# EasyEDA Pro project ProProject_运放实验_2024-09-24.epro, board PCB2
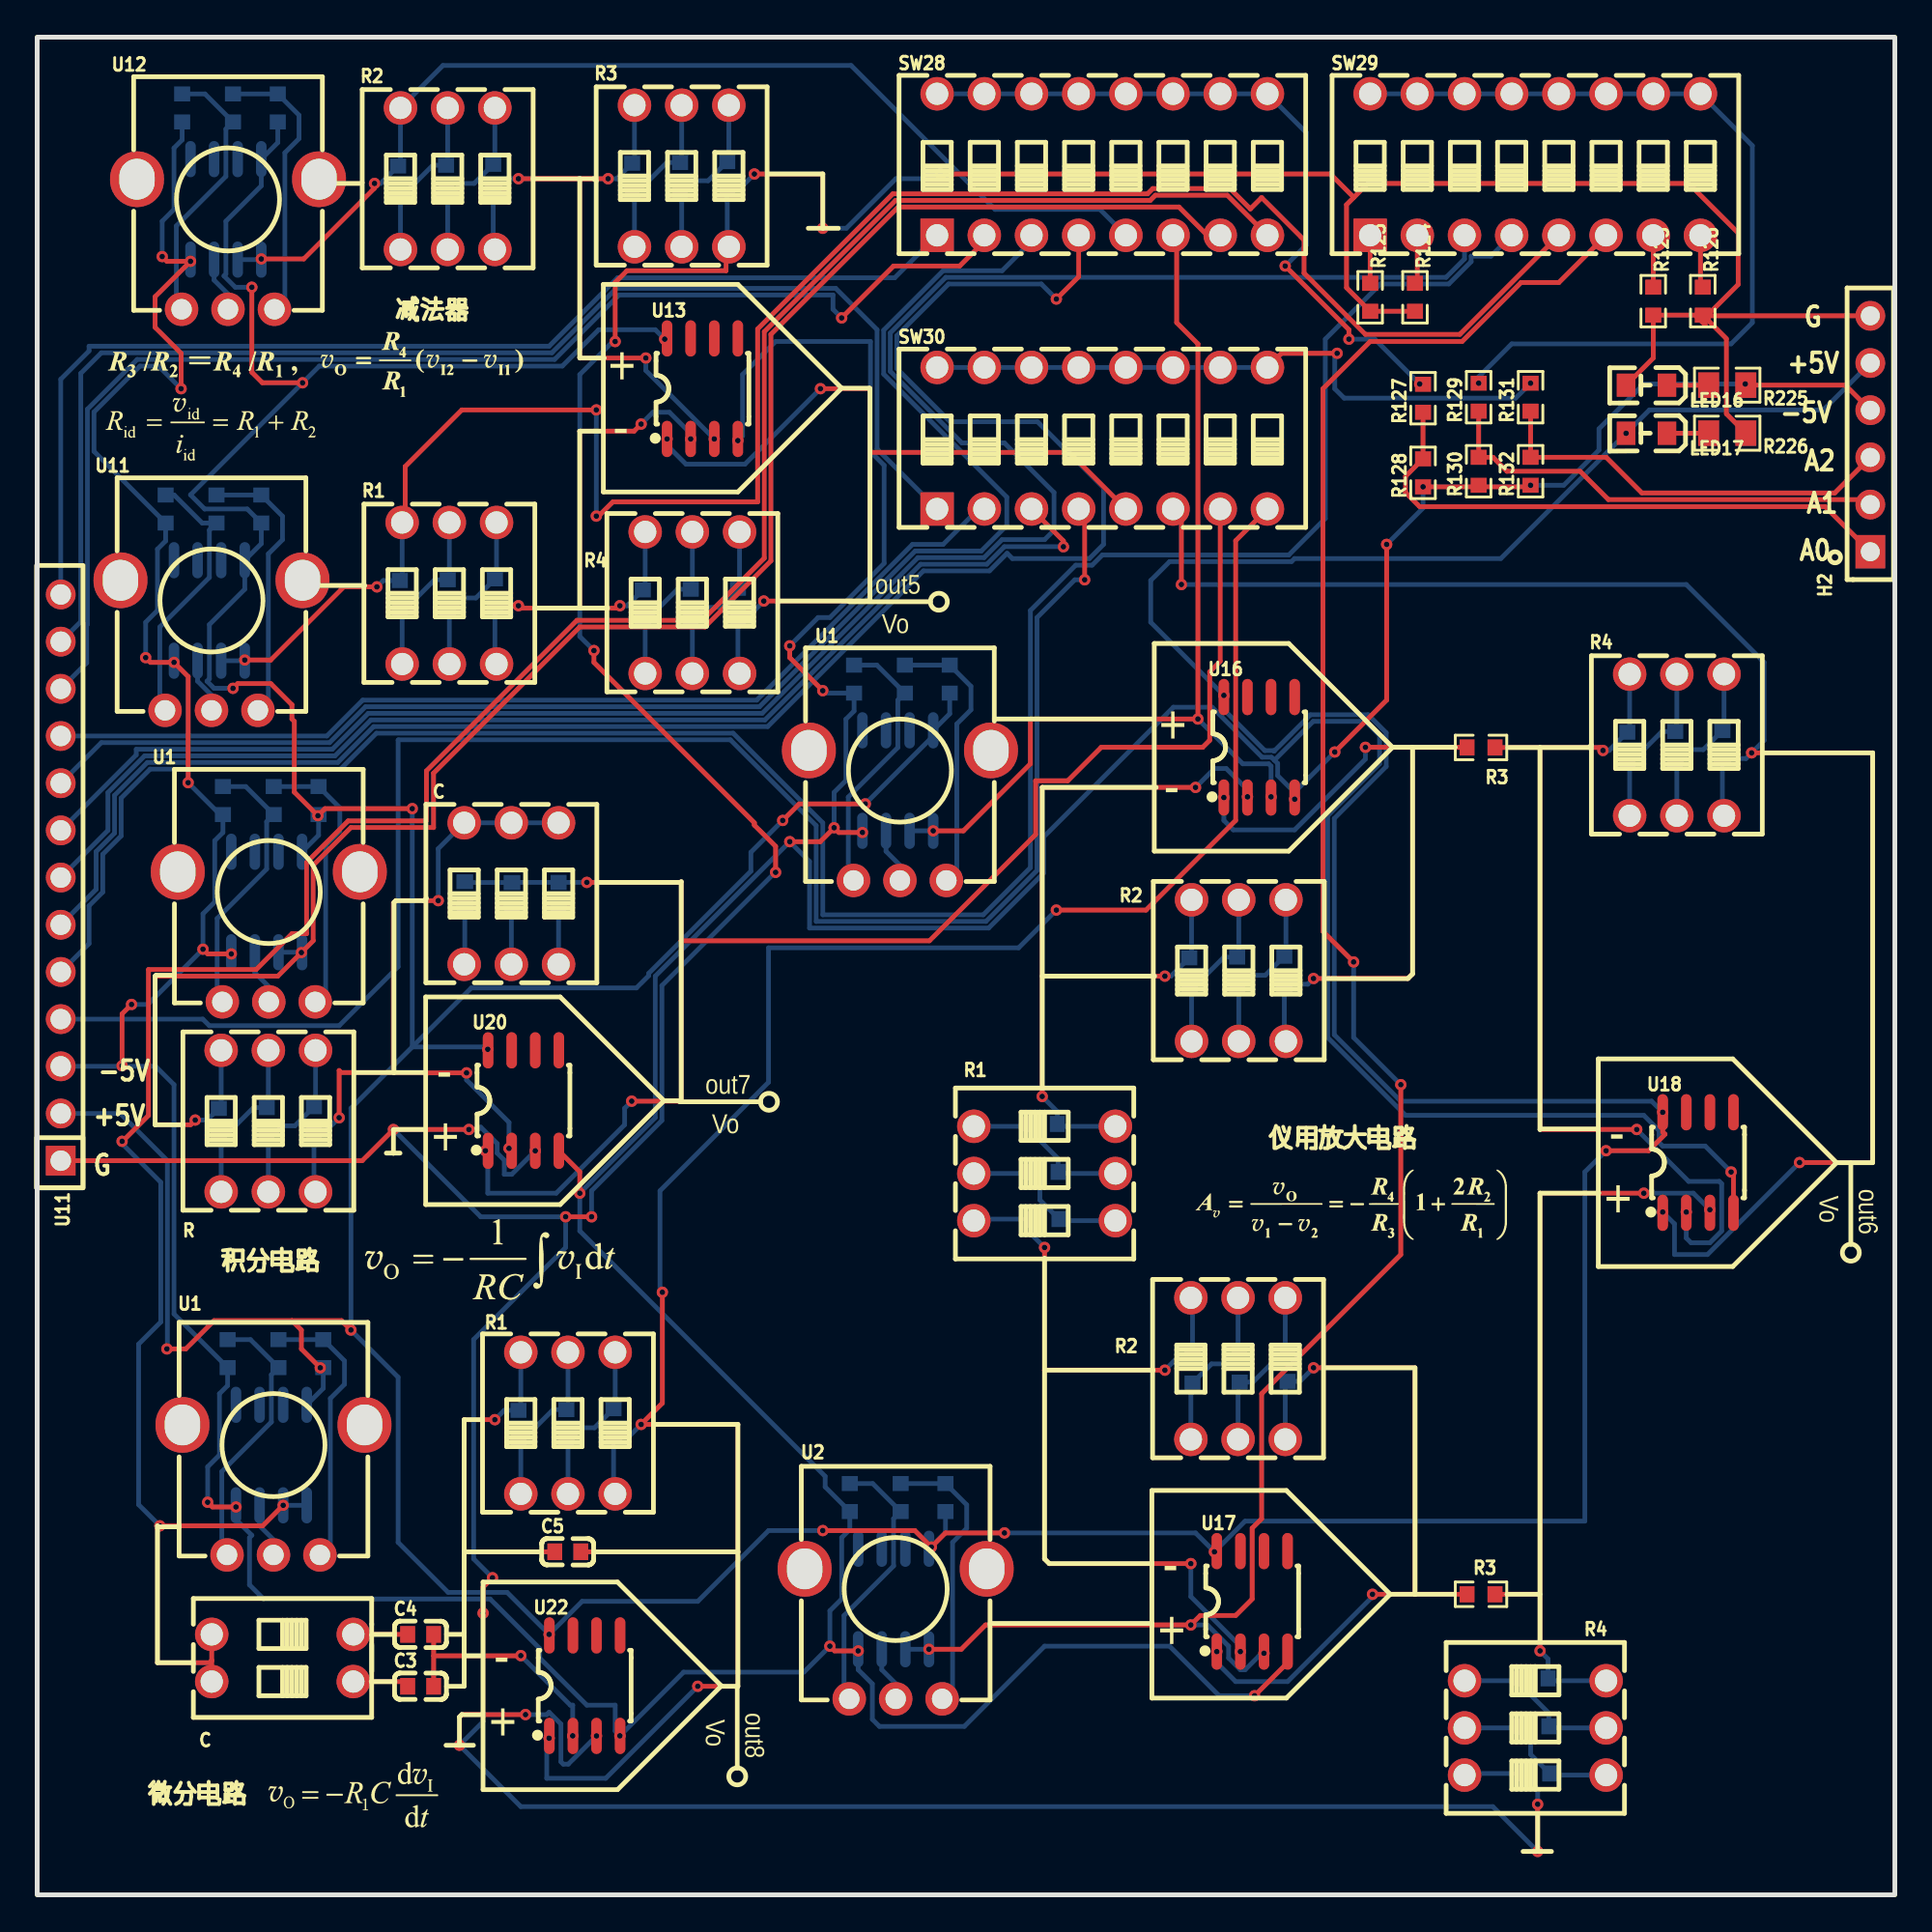
[diagram p11: board, top side]
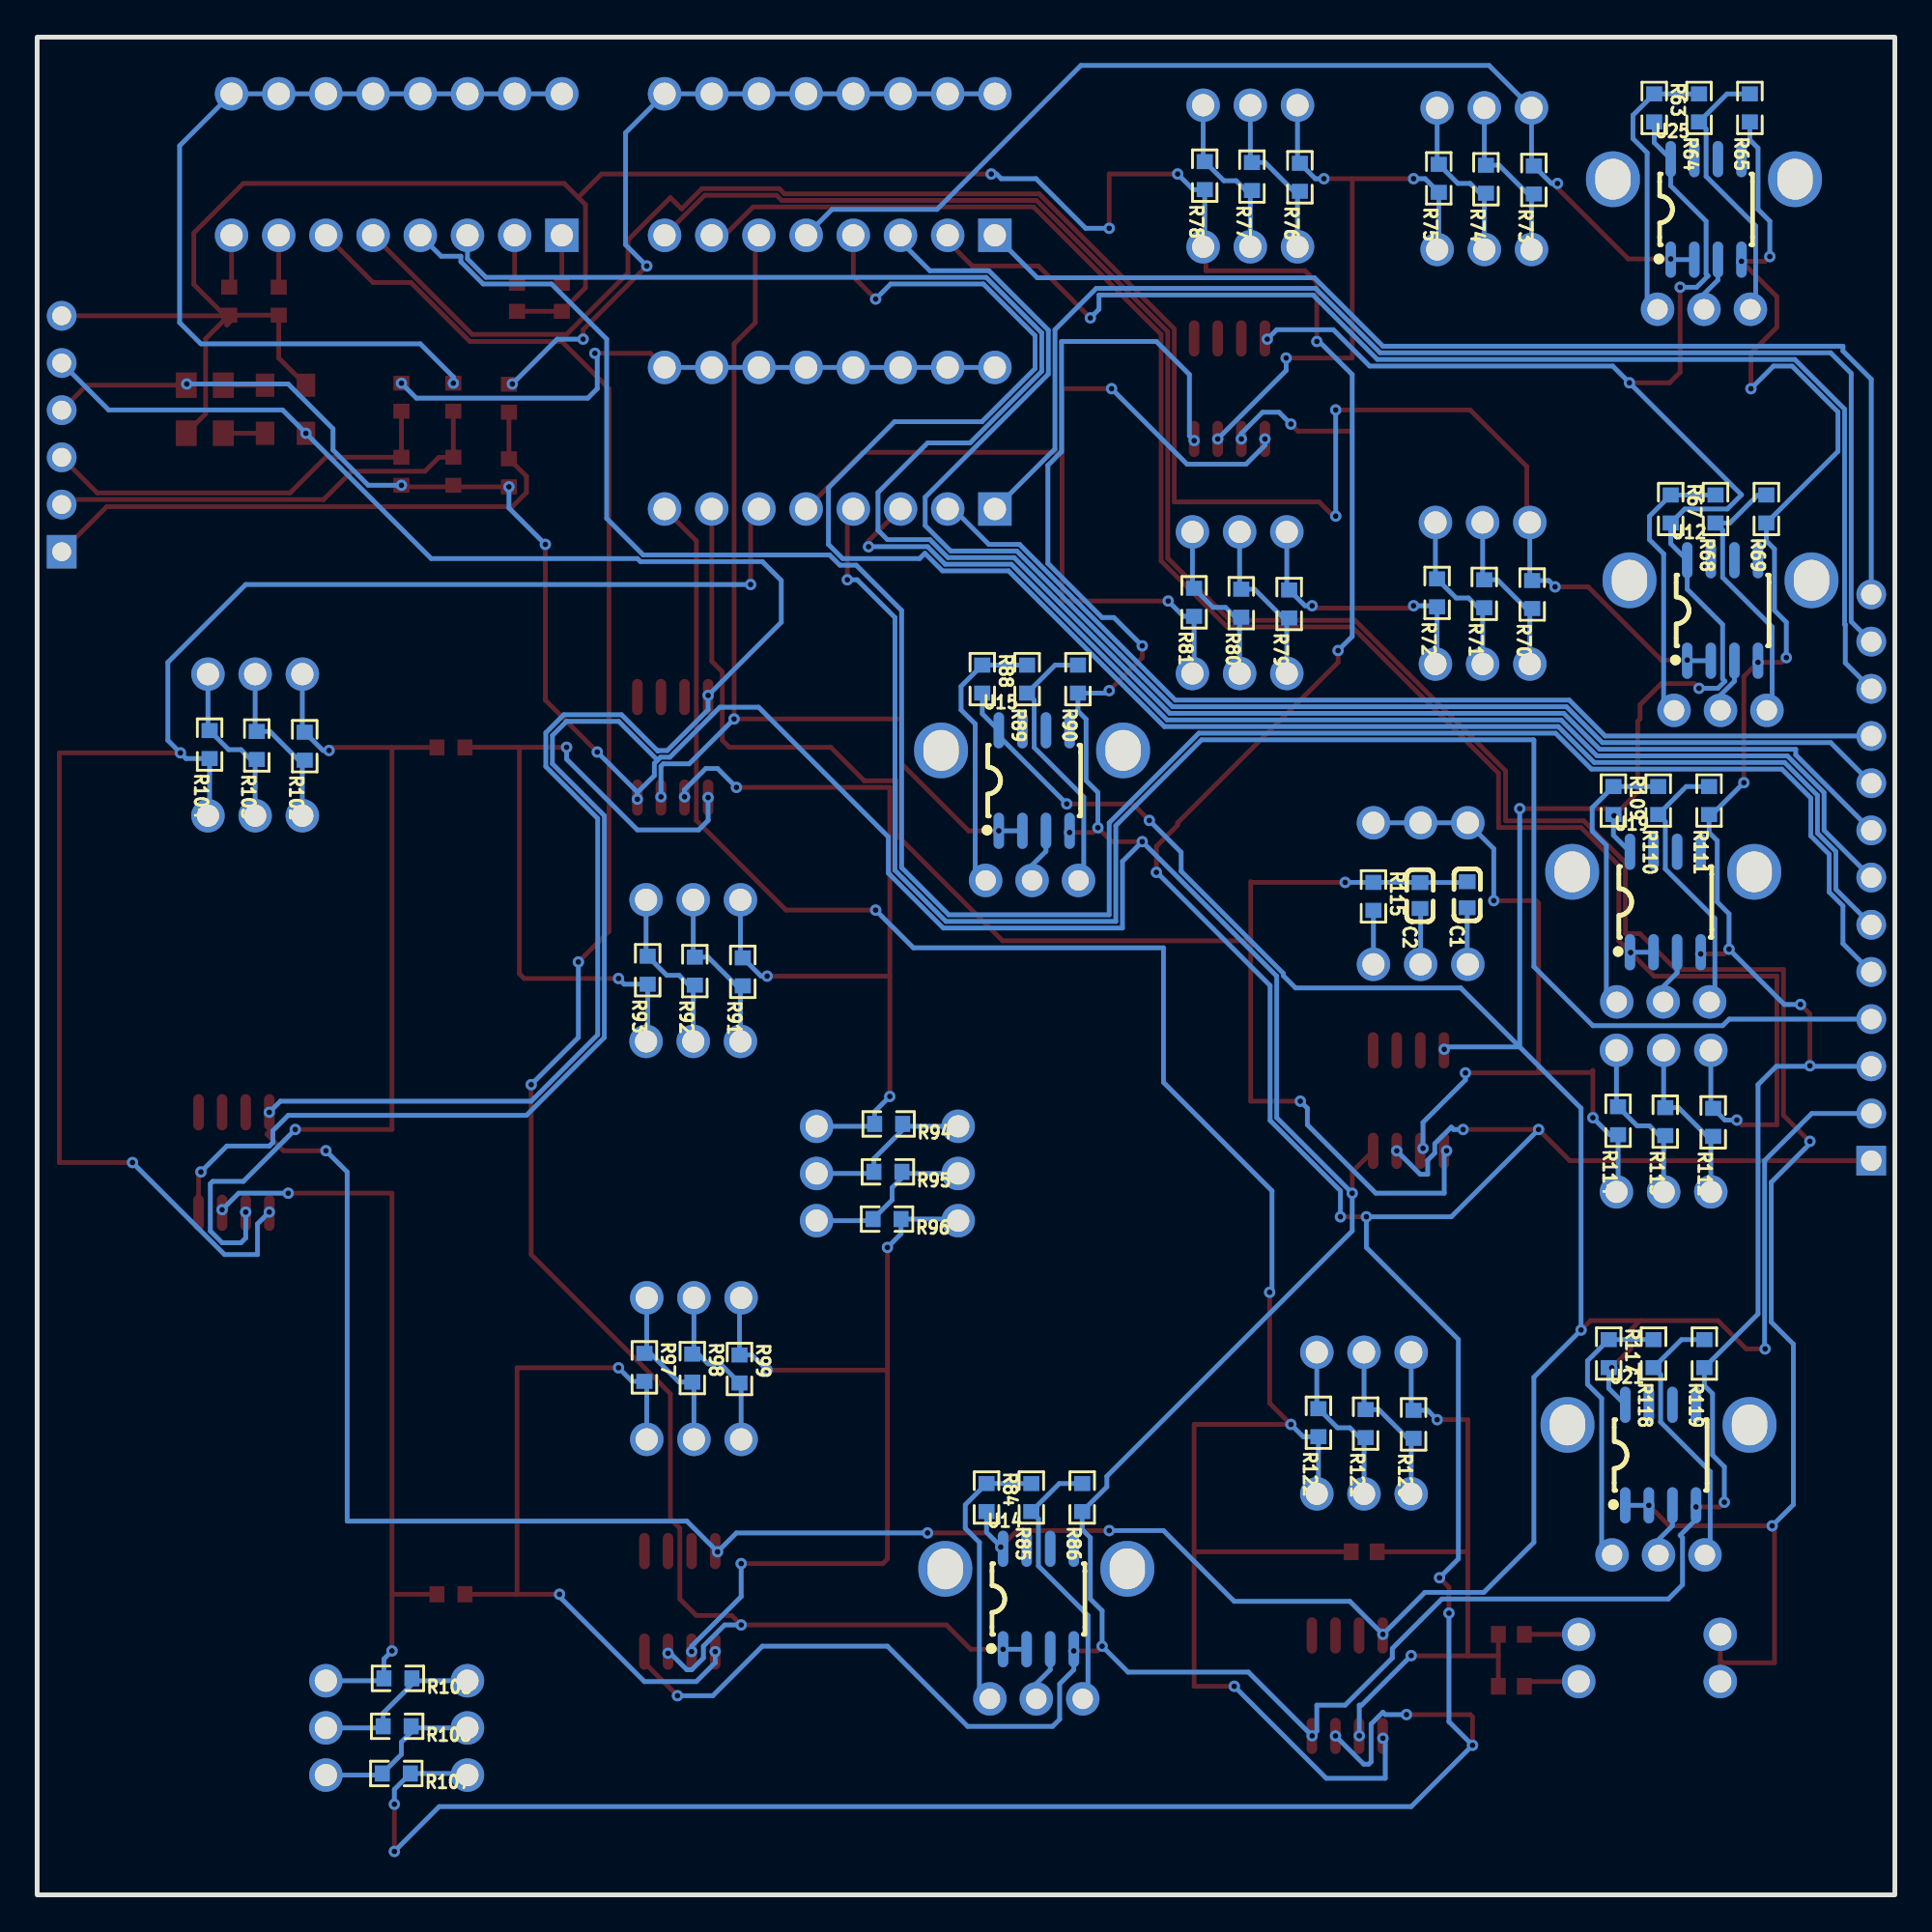
[diagram p12: board, bottom side, seen from below]

Outline 100 x 100 mm; copper layers: Top Layer, Bottom Layer. Coordinates in mm from the lower left corner of the outline.
Outline path: rectangle 0,100 100,0
Stack: Top Layer 0.035mm - / Dielectric1 1.51mm FR4 er 4.5 / Bottom Layer 0.035mm -

## Design rules (mm)
template: JLCPCB Capability(Two Layers Board)
spacing copperThickness1oz (default): track to track 0.102, other pairs 0.152 to 0.3
spacing copperThickness2oz: track to track 0.203, other pairs 0.152 to 0.3
track width copperThickness1oz (default): min 0.127, default 0.254, max 2.54
track width copperThickness2oz: min 0.203, default 0.254, max 2.54
differential pair differentialPair (default): width min 0.127, default 0.254, max 2.54; gap min 0.152, default 0.152
via viaSize (default): diameter min 0.5, default 0.61, max 10; hole min 0.3, default 0.305, max 6.3

## Placement (name value [footprint] x y rotation side)
C  -  [SW-TH_DSWB02LHGET]  13.21 12.75 90 top
C1  100uF  [C0603]  23.02 53.84 90 bottom
C2  1uF  [C0603]  25.56 53.79 90 bottom
C3  100uF  [C0603]  20.64 11.23 0 top
C4  1uF  [C0603]  20.64 14.02 0 top
C5  1uF  [C0603]  28.56 18.47 0 top
C#2  -  [SW-TH_DSWB03LHGET]  25.53 53.9 0 top
H2  PM254V-11-06-H85  [HDR-TH_6P-P2.54-V-F]  98.68 78.65 90 top
LED16  -  [LED_0805]  86.58 81.27 180 top
LED17  -  [LED_0805]  86.58 78.68 180 top
R  DSWB03LHGET  [SW-TH_DSWB03LHGET]  12.45 41.65 0 top
R1  -  [SW-TH_DSWB03LHGET]  54.23 38.83 270 top
R1#2  -  [SW-TH_DSWB03LHGET]  22.19 70.06 0 top
R1#3  -  [SW-TH_DSWB03LHGET]  28.57 25.4 0 top
R2  -  [SW-TH_DSWB03LHGET]  64.65 28.33 180 top
R2#2  -  [SW-TH_DSWB03LHGET]  64.68 49.75 0 top
R2#3  -  [SW-TH_DSWB03LHGET]  22.1 92.38 0 top
R3  -  [SW-TH_DSWB03LHGET]  34.69 92.53 0 top
R3#2  -  [R0603]  77.72 16.18 180 top
R3#3  -  [R0603]  77.72 61.76 180 top
R4  -  [SW-TH_DSWB03LHGET]  80.65 8.99 270 top
R4#2  -  [SW-TH_DSWB03LHGET]  88.26 61.9 0 top
R4#3  -  [SW-TH_DSWB03LHGET]  35.27 69.56 0 top
R63  4kΩ  [R0603]  12.95 96.19 270 bottom
R64  2kΩ  [R0603]  10.54 96.19 90 bottom
R65  4kΩ  [R0603]  7.81 96.19 90 bottom
R67  4kΩ  [R0603]  12.06 74.6 270 bottom
R68  2kΩ  [R0603]  9.65 74.6 90 bottom
R69  4kΩ  [R0603]  6.92 74.6 90 bottom
R70  1kΩ  [R0603]  19.52 70 90 bottom
R71  1kΩ  [R0603]  22.1 70.04 90 bottom
R72  1kΩ  [R0603]  24.64 70.08 90 bottom
R73  1kΩ  [R0603]  19.43 92.31 90 bottom
R74  1kΩ  [R0603]  22.01 92.35 90 bottom
R75  1kΩ  [R0603]  24.55 92.4 90 bottom
R76  1kΩ  [R0603]  32.03 92.46 90 bottom
R77  1kΩ  [R0603]  34.61 92.5 90 bottom
R78  1kΩ  [R0603]  37.15 92.55 90 bottom
R79  1kΩ  [R0603]  32.6 69.49 90 bottom
R80  1kΩ  [R0603]  35.18 69.53 90 bottom
R81  1kΩ  [R0603]  37.72 69.58 90 bottom
R84  4kΩ  [R0603]  48.9 21.39 270 bottom
R85  2kΩ  [R0603]  46.48 21.39 90 bottom
R86  4kΩ  [R0603]  43.75 21.39 90 bottom
R88  4kΩ  [R0603]  49.12 65.44 270 bottom
R89  2kΩ  [R0603]  46.71 65.44 90 bottom
R90  4kΩ  [R0603]  43.97 65.44 90 bottom
R91  1kΩ  [R0603]  62.02 49.69 90 bottom
R92  1kΩ  [R0603]  64.6 49.72 90 bottom
R93  1kΩ  [R0603]  67.14 49.77 90 bottom
R94  1kΩ  [R0603]  54.16 41.5 0 bottom
R95  1kΩ  [R0603]  54.2 38.92 0 bottom
R96  1kΩ  [R0603]  54.25 36.38 0 bottom
R97  1kΩ  [R0603]  67.31 28.4 270 bottom
R98  1kΩ  [R0603]  64.73 28.36 270 bottom
R99  1kΩ  [R0603]  62.19 28.31 270 bottom
R102  1kΩ  [R0603]  85.6 61.83 90 bottom
R103  1kΩ  [R0603]  88.18 61.87 90 bottom
R104  1kΩ  [R0603]  90.72 61.92 90 bottom
R105  1kΩ  [R0603]  80.58 11.65 0 bottom
R106  1kΩ  [R0603]  80.62 9.07 0 bottom
R107  1kΩ  [R0603]  80.67 6.53 0 bottom
R109  4kΩ  [R0603]  15.15 58.91 270 bottom
R110  2kΩ  [R0603]  12.74 58.91 90 bottom
R111  4kΩ  [R0603]  10 58.91 90 bottom
R112  1kΩ  [R0603]  9.78 41.58 90 bottom
R113  1kΩ  [R0603]  12.36 41.62 90 bottom
R114  1kΩ  [R0603]  14.9 41.67 90 bottom
R115  1MΩ  [R0603]  28.07 53.75 270 bottom
R117  4kΩ  [R0603]  15.4 29.14 270 bottom
R118  2kΩ  [R0603]  12.99 29.14 90 bottom
R119  4kΩ  [R0603]  10.25 29.14 90 bottom
R120  1kΩ  [R0603]  25.91 25.33 90 bottom
R121  1kΩ  [R0603]  28.49 25.37 90 bottom
R122  1kΩ  [R0603]  31.03 25.41 90 bottom
R123  1kΩ  [R0603]  71.75 86 270 top
R124  1kΩ  [R0603]  74.17 86 270 top
R125  1kΩ  [R0603]  87 85.79 270 top
R126  1kΩ  [R0603]  89.66 85.79 270 top
R127  7kΩ  [R0603]  74.6 80.56 90 top
R128  3kΩ  [R0603]  74.6 76.55 90 top
R129  7kΩ  [R0603]  77.6 80.62 90 top
R130  3kΩ  [R0603]  77.6 76.63 90 top
R131  7kΩ  [R0603]  80.39 80.62 90 top
R132  3kΩ  [R0603]  80.39 76.63 90 top
R225  1k  [R0805]  90.98 81.27 180 top
R226  1k  [R0805]  90.98 78.68 180 top
SW28  DSWB08LHGET  [SW-TH_DSWB08LHGET]  57.34 93.14 0 top
SW29  DSWB08LHGET  [SW-TH_DSWB08LHGET]  80.65 93.14 0 top
SW30  DSWB08LHGET  [SW-TH_DSWB08LHGET]  57.34 78.41 0 top
U1  -  [RES-ADJ-TH_RK09K1130AJ3]  12.47 51.57 0 top
U1#2  -  [RES-ADJ-TH_RK09K1130AJ3]  46.44 58.11 0 top
U1#3  -  [RES-ADJ-TH_RK09K1130AJ3]  12.72 21.8 0 top
U2  1kΩ  [RES-ADJ-TH_RK09K1130AJ3]  46.22 14.05 0 top
U11  PM254-1-13-Z-8.5  [RES-ADJ-TH_RK09K1130AJ3]  9.39 67.26 0 top
U11#2  -  [HDR-TH_13P-P2.54-V-F]  1.27 54.76 90 top
U12  LM393DR  [RES-ADJ-TH_RK09K1130AJ3]  10.27 88.85 0 top
U12#2  -  [SOIC-8_L5.0-W4.0-P1.27-LS6.0-BL]  9.27 69.14 180 bottom
U13  LM393DR  [SOIC-8_L5.0-W4.0-P1.27-LS6.0-BL]  35.81 81.08 0 top
U14  LM393DR  [SOIC-8_L5.0-W4.0-P1.27-LS6.0-BL]  46.1 15.93 180 bottom
U15  LM393DR  [SOIC-8_L5.0-W4.0-P1.27-LS6.0-BL]  46.33 59.98 180 bottom
U16  LM393DR  [SOIC-8_L5.0-W4.0-P1.27-LS6.0-BL]  65.79 61.77 0 top
U17  LM393DR  [SOIC-8_L5.0-W4.0-P1.27-LS6.0-BL]  65.41 15.8 0 top
U18  LM393DR  [SOIC-8_L5.0-W4.0-P1.27-LS6.0-BL]  89.41 39.42 0 top
U19  LM393DR  [SOIC-8_L5.0-W4.0-P1.27-LS6.0-BL]  12.36 53.45 180 bottom
U20  LM393DR  [SOIC-8_L5.0-W4.0-P1.27-LS6.0-BL]  26.18 42.76 0 top
U21  LM393DR  [SOIC-8_L5.0-W4.0-P1.27-LS6.0-BL]  12.61 23.67 180 bottom
U22  LM393DR  [SOIC-8_L5.0-W4.0-P1.27-LS6.0-BL]  29.48 11.26 0 top
U25  LM393DR  [SOIC-8_L5.0-W4.0-P1.27-LS6.0-BL]  10.16 90.73 180 bottom

## Footprints (pads in the part's own frame, mm; a bottom-side part is the same pattern mirrored in y, then rotated)
C0603
  rect 0.8x0.9 smd: 1(-0.7,0) 2(0.7,0)
HDR-TH_6P-P2.54-V-F
  rect 1.8x1.6 hole 1.02: 1(-6.35,0)
  round 1.6 hole 1.02: 2(-3.81,0) 3(-1.27,0) 4(1.27,0) 5(3.81,0) 6(6.35,0)
HDR-TH_13P-P2.54-V-F
  rect 1.6x1.6 hole 1.1: 1(-15.24,0)
  round 1.6 hole 1.1: 2(-12.7,0) 3(-10.16,0) 4(-7.62,0) 5(-5.08,0) 6(-2.54,0) 7(0,0) 8(2.54,0) 9(5.08,0) 10(7.62,0) 11(10.16,0) 12(12.7,0) 13(15.24,0)
LED_0805
  rect 1x1.25 smd: 1(-1.15,0.005) 2(1.05,0.005)
R0603
  rect 0.806x0.864 smd: 1(-0.753,0) 2(0.753,0)
R0805
  rect 1.133x1.377 smd: 1(-1,0) 2(1,0)
RES-ADJ-TH_RK09K1130AJ3
  round 1.8 hole 1.1: 1(-2.5,-3.5) 2(0,-3.5) 3(2.5,-3.5)
  oval 2.9x3 hole 1.9x2.2: 4(-4.9,3.5) 5(4.9,3.5)
SOIC-8_L5.0-W4.0-P1.27-LS6.0-BL
  oval 0.569x1.95 smd: 1(-1.905,-2.705) 2(-0.635,-2.705) 3(0.635,-2.705) 4(1.905,-2.705) 5(1.905,2.705) 6(0.635,2.705) 7(-0.635,2.705) 8(-1.905,2.705)
SW-TH_DSWB02LHGET
  round 1.8 hole 1.2: 1(-1.27,3.81) 2(1.27,3.81) 3(-1.27,-3.81) 4(1.27,-3.81)
SW-TH_DSWB03LHGET
  round 1.8 hole 1.2: 1(-2.54,3.81) 2(0,3.81) 3(2.54,3.81) 4(-2.54,-3.81) 5(0,-3.81) 6(2.54,-3.81)
SW-TH_DSWB08LHGET
  rect 1.8x1.8 hole 1.2: 1(-8.89,-3.81)
  round 1.8 hole 1.2: 2(-6.35,-3.81) 3(-3.81,-3.81) 4(-1.27,-3.81) 5(1.27,-3.81) 6(3.81,-3.81) 7(6.35,-3.81) 8(8.89,-3.81) 9(-8.89,3.81) 10(-6.35,3.81) 11(-3.81,3.81) 12(-1.27,3.81) 13(1.27,3.81) 14(3.81,3.81) 15(6.35,3.81) 16(8.89,3.81)

## Nets
+5V: H2.5 LED17.2 R63.2 R67.2 R84.2 R88.2 R109.2 R117.2 U11#2.2 U12#2.8 U13.8 U14.8 U15.8 U16.8 U17.8 U18.8 U19.8 U20.8 U21.8 U22.8 U25.8
-5V: H2.4 R65.1 R69.1 R86.1 R90.1 R111.1 R119.1 R128.1 R130.1 R132.1 R225.1 U11#2.3 U12#2.4 U13.4 U14.4 U15.4 U16.4 U17.4 U18.4 U19.4 U20.4 U21.4 U22.4 U25.4
GND: H2.6 LED16.2 R3.6 R4.6 R78.1 R107.1 R123.2 R124.2 R125.2 R126.2 R226.1 U11#2.1 U20.3 U22.3
1_FAN_XIANG_BI_LI_QI_IN: SW28.1 U11#2.13
1_FAN_XIANG_BI_LI_QI_OUT: SW30.1 U11#2.12
2_TONG_XIANG_BI_LI_QI_IN: SW28.2 U11#2.11
2_TONG_XIANG_BI_LI_QI_OUT: SW30.2 U11#2.10
3_TONG_XIANG_JIA_FA_QI_IN1: SW28.3 U11#2.9
3_TONG_XIANG_JIA_FA_QI_IN2: SW29.3 U11#2.8
3_TONG_XIANG_JIA_FA_QI_OUT: SW30.3 U11#2.7
4_FAN_XIANG_JIA_FA_QI_IN1: SW28.4 U11#2.6
4_FAN_XIANG_JIA_FA_QI_IN2: SW29.4 U11#2.5
4_FAN_XIANG_JIA_FA_QI_OUT: SW30.4 U11#2.4
5_JIAN_FA_QI_IN1: R2#3.1 R73.2 SW28.5 U25.1 U25.2
5_JIAN_FA_QI_IN2: R1#2.1 R70.2 SW29.5 U12#2.1 U12#2.2
5_JIAN_FA_QI_OUT: R4#3.6 R81.1 SW30.5 U13.1
6_YI_YONG_FANG_DA_QI_IN1: SW28.6 U15.1 U15.2 U16.3
6_YI_YONG_FANG_DA_QI_IN2: SW29.6 U14.1 U14.2 U17.3
6_YI_YONG_FANG_DA_QI_OUT: R4#2.6 R104.1 SW30.6 U18.1
7_JI_FEN_IN: R.1 R112.2 SW28.7 U19.1 U19.2
7_JI_FEN_OUT: C1.2 C2.2 R115.1 SW30.7 U20.1
8_WEI_FEN_IN: C.1 C.2 SW28.8 U21.1 U21.2
8_WEI_FEN_OUT: C5.2 R1#3.6 R122.1 SW30.8 U22.1
A0: H2.1 R127.1 R128.2
A1: H2.2 R129.1 R130.2
A2: H2.3 R131.1 R132.2
$1N40974: R63.1 R64.2 U12.3
$1N40975: R64.1 R65.2 U12.1
$1N40980: U12.2 U25.3
$1N40985: R67.1 R68.2 U11.3
$1N40986: R68.1 R69.2 U11.1
$1N40991: U11.2 U12#2.3
$1N40994: R1#2.2 R1#2.4 R70.1 R71.2
$1N40995: R1#2.3 R1#2.5 R71.1 R72.2
$1N40996: R2#3.2 R2#3.4 R73.1 R74.2
$1N40997: R2#3.3 R2#3.5 R74.1 R75.2
$1N41006: R3.2 R3.4 R76.1 R77.2
$1N41007: R3.3 R3.5 R77.1 R78.2
$1N41009: R2#3.6 R3.1 R75.1 R76.2 U13.3
$1N41010: R4#3.2 R4#3.4 R79.1 R80.2
$1N41011: R4#3.3 R4#3.5 R80.1 R81.2
$1N41012: R1#2.6 R4#3.1 R72.1 R79.2 U13.2
$1N41017: R84.1 R85.2 U2.3
$1N41018: R85.1 R86.2 U2.1
$1N41023: U2.2 U14.3
$1N41028: R88.1 R89.2 U1#2.3
$1N41029: R89.1 R90.2 U1#2.1
$1N41034: U1#2.2 U15.3
$1N41045: R2#2.2 R2#2.4 R91.1 R92.2
$1N41046: R2#2.3 R2#2.5 R92.1 R93.2
$1N41047: R1.2 R1.4 R94.1 R95.2
$1N41048: R1.3 R1.5 R95.1 R96.2
$1N41049: R2.2 R2.4 R97.1 R98.2
$1N41050: R2.3 R2.5 R98.1 R99.2
$1N41051: R1.1 R2#2.1 R91.2 R94.2 U16.2
$1N41052: R2#2.6 R3#3.2 R93.1 U16.1
$1N41053: R1.6 R2.6 R96.1 R99.1 U17.2
$1N41058: R2.1 R3#2.2 R97.2 U17.1
$1N41063: R4#2.2 R4#2.4 R102.1 R103.2
$1N41064: R4#2.3 R4#2.5 R103.1 R104.2
$1N41065: R4.2 R4.4 R105.1 R106.2
$1N41066: R4.3 R4.5 R106.1 R107.2
$1N41068: R3#2.1 R4.1 R105.2 U18.3
$1N41069: R3#3.1 R4#2.1 R102.2 U18.2
$1N41074: R109.1 R110.2 U1.3
$1N41075: R110.1 R111.2 U1.1
$1N41080: U1.2 U19.3
$1N41087: R.2 R.4 R112.1 R113.2
$1N41088: R.3 R.5 R113.1 R114.2
$1N41092: C1.1 C#2.4
$1N41093: C2.1 C#2.5
$1N41094: C#2.1 C#2.2 C#2.3 R.6 R114.1 U20.2
$1N41095: C#2.6 R115.2
$1N41100: R117.1 R118.2 U1#3.3
$1N41101: R118.1 R119.2 U1#3.1
$1N41106: U1#3.2 U21.3
$1N41114: R1#3.2 R1#3.4 R120.1 R121.2
$1N41115: R1#3.3 R1#3.5 R121.1 R122.2
$1N41116: C.3 C3.1
$1N41117: C.4 C4.1
$1N41120: C3.2 C4.2 C5.1 R1#3.1 R120.2 U22.2
$1N41163: R123.1 SW29.1
$1N41164: R124.1 SW29.2
$1N41165: R125.1 SW29.7
$1N41166: R126.1 SW29.8
$1N41258: R127.2 SW28.9 SW28.10 SW28.11 SW28.12 SW28.13 SW28.14 SW28.15 SW28.16
$1N41259: R129.2 SW29.9 SW29.10 SW29.11 SW29.12 SW29.13 SW29.14 SW29.15 SW29.16
$1N41260: R131.2 SW30.9 SW30.10 SW30.11 SW30.12 SW30.13 SW30.14 SW30.15 SW30.16
$1N44165: LED16.1 R225.2
$1N44169: LED17.1 R226.2

Pads without a net: U1 4 5; U1#2 4 5; U1#3 4 5; U2 4 5; U11 4 5; U12 4 5; U12#2 5 6 7; U13 5 6 7; U14 5 6 7; U15 5 6 7; U16 5 6 7; U17 5 6 7; U18 5 6 7; U19 5 6 7; U20 5 6 7; U21 5 6 7; U22 5 6 7; U25 5 6 7

## Via types
v1: diameter 0.61, hole 0.305, Top Layer to Bottom Layer, 148 vias

## Routing (per net, layer and track width the routed paths; a pad name or vN(x,y) marks a point on that pad's centre or on a via; arc(x,y) is an arc through that point)
+5V: length 397.8
  Top Layer w0.254: 13.72,30.91 16.38,30.91 v1(16.89,30.4) ; 13.72,30.91 9.53,30.91 8,29.39 v1(6.98,29.39) ; 13.72,30.91 14.22,30.4 14.22,29.39 v1(15.24,28.37) ; v1(44.58,58.72) 41.02,58.72 v1(40.13,57.84) ; U22.8 27.57,14.01 v1(27.56,14.02) ; v1(14.29,81.39) 12.13,81.39 11.56,81.97 v1(11.56,86.54) ; v1(42.29,19.61) 47.24,19.61 v1(48.13,18.72) 48.9,19.48 v1(52.07,19.48) ; v1(33.78,83.74) 33.87,83.74 U13.8 ; v1(84.46,40.06) 86.74,40.06 87.63,40.94 87.5,41.07 v1(87.5,42.13) ; U20.8 24.27,45.5 v1(24.26,45.52) ; U17.8 63.46,18.47 v1(63.37,18.47) ; v1(63.88,64.57) U16.8 ; v1(10.54,64.95) 10.8,65.2 12.57,65.2 13.72,64.06 13.72,63.3 13.84,63.17 13.84,59.36 v1(15.11,58.09) 15.49,58.47 v1(20.19,58.47)
  Bottom Layer w0.254: v1(44.58,58.72) 48.23,62.38 U15.8 49.12,63.58 R88.2 ; R84.2 48.9,19.52 U14.8 48.04,18.63 v1(48.13,18.72) ; v1(84.46,40.06) 83.31,38.91 83.31,20.12 65.02,20.12 v1(63.37,18.47) 62.36,19.48 v1(52.07,19.48) ; 20.19,45.64 16.89,42.34 v1(16.89,30.4) 19.43,27.86 19.43,18.97 22.12,16.28 25.3,16.28 v1(27.56,14.02) 29.34,15.8 35.56,15.8 39.37,19.61 v1(42.29,19.61) ; 20.19,45.64 24.13,45.64 v1(24.26,45.52) ; 20.19,45.64 v1(20.19,58.47) ; 20.19,45.64 23.37,48.82 32.26,48.82 32.92,49.48 32.92,49.6 38.42,55.1 38.42,56.12 v1(40.13,57.84) ; v1(87.5,42.13) 86.91,42.72 73.4,42.72 69.82,46.3 69.82,57.94 72.62,60.74 72.62,62.56 71.65,63.53 68.54,63.53 66.58,61.57 66.59,61.6 66.09,61.6 63.88,63.8 v1(63.88,64.57) 59.94,68.5 59.94,70.75 60.96,71.77 67.52,71.77 67.69,71.93 78.79,71.93 v1(85.53,78.68) 86.79,79.93 96.15,79.93 H2.5 ; v1(6.98,29.39) 7.01,29.41 7.01,39.52 4.47,42.06 U11#2.2 ; U21.8 15.4,27.27 R117.2 15.39,28.37 v1(15.24,28.37) ; v1(10.54,64.95) 9.53,64.95 9.14,65.33 9.27,65.46 9.27,68.38 11.18,70.28 U12#2.8 12.06,72.73 R67.2 11.31,74.6 9.02,74.6 8.25,75.36 v1(14.29,81.39) 15.19,82.3 28.27,82.3 30.23,84.25 33.27,84.25 v1(33.78,83.74) ; U19.8 15.15,57.04 R109.2 15.11,58.12 v1(15.11,58.09) ; R63.2 12.95,94.32 U25.8 12.06,92 10.16,90.09 10.16,87.25 10.06,87.15 10.67,86.54 v1(11.56,86.54)
-5V: length 418.7
  Top Layer w0.254: v1(29.21,37.77) 29.21,38.92 U20.4 ; v1(7.75,81.08) 7.75,82.98 6.35,84.38 6.35,86.03 v1(8.25,87.94) 6.98,87.94 v1(6.73,88.19) ; v1(44.2,13.13) 42.93,13.13 v1(42.67,13.39) ; v1(91.95,81.33) 91.98,81.3 R225.1 97.33,81.27 H2.4 ; v1(44.42,57.19) 43.15,57.19 v1(42.9,57.44) 42.15,56.69 v1(40.51,56.69) ; v1(67.69,58.98) U16.4 ; v1(65.53,10.72) 67.31,12.5 U17.4 ; v1(74.6,75.79) 80.31,75.79 v1(80.39,75.88) ; v1(4.57,44.63) 4.57,47.42 v1(5.08,47.93) ; v1(69.85,61.52) 72.64,64.31 v1(72.64,72.69) ; v1(10.7,20.88) 9.43,20.88 v1(9.18,21.13) ; U22.4 31.37,8.56 v1(31.37,8.56) ; v1(10.45,50.65) 9.18,50.65 v1(8.93,50.91) ; v1(37.72,78.28) U13.4 ; v1(8.13,59.87) 8.13,65.58 v1(7.37,66.34) 6.1,66.34 v1(5.84,66.6) ; v1(91.19,38.91) 91.31,38.79 U18.4 ; v1(42.29,64.82) 40.51,66.6 v1(40.51,67.23)
  Bottom Layer w0.254: 4.56,44.6 4.57,44.61 v1(4.57,44.63) ; 4.56,44.6 6.38,44.6 7.37,43.61 7.37,31.27 R119.1 10.25,27.42 9.81,26.98 9.81,23.67 9.18,23.04 v1(9.18,21.13) ; 4.56,44.6 U11#2.3 ; v1(7.75,81.08) 6.53,82.3 5.53,82.3 3.06,79.83 3.06,77.7 R69.1 6.92,72.88 6.48,72.44 6.48,69.14 5.84,68.5 v1(5.84,66.6) ; 66.6,61.08 66.44,61.24 65.94,61.24 63.25,63.93 61.16,63.93 54.18,56.95 54.18,55 51.22,52.04 41.58,52.04 41.58,55.63 v1(40.51,56.69) 33.27,49.45 33.27,41.83 v1(29.21,37.77) 29.21,35.74 42.42,22.53 42.42,21.96 R86.1 43.75,19.67 43.31,19.23 43.31,15.93 42.67,15.29 v1(42.67,13.39) 41.28,11.99 34.8,11.99 v1(31.37,8.56) 31.12,8.81 31.12,10.21 29.59,10.21 27.05,12.75 27.05,13.26 24.38,15.93 12.19,15.93 11.43,16.69 11.43,19.23 11.56,19.35 10.7,20.21 v1(10.7,20.88) 10.7,20.97 ; 66.6,61.08 68.69,63.17 71.5,63.17 72.26,62.41 72.26,60.88 69.47,58.09 69.47,46.15 73.66,41.96 86.49,41.96 87.31,41.14 87.31,40.5 87.5,40.31 89.79,40.31 v1(91.19,38.91) ; 66.6,61.08 66.78,60.9 66.78,60.25 67.69,59.33 ; v1(42.9,57.44) 42.9,59.35 43.54,59.98 43.54,63.28 43.97,63.72 R90.1 42.42,64.69 v1(42.29,64.82) ; 67.69,59.33 67.69,59.36 v1(69.85,61.52) ; 67.69,59.33 v1(67.69,58.98) ; v1(40.51,67.23) 42.04,68.76 42.68,68.76 45.59,71.67 45.59,76.95 44.86,77.69 44.86,83.62 39.75,83.62 37.97,81.84 37.97,78.54 v1(37.72,78.28) ; v1(10.45,50.65) U19.4 ; R65.1 7.81,94.47 7.37,94.03 7.37,90.73 6.73,90.09 v1(6.73,88.19) ; v1(80.39,75.88) 82.18,75.88 84.07,77.78 84.07,78.92 86.49,81.33 v1(91.95,81.33) ; U14.4 v1(44.2,13.13) 44.2,12.12 44.96,11.36 44.96,9.45 45.34,9.07 49.91,9.07 54.23,13.39 60.96,13.39 63.63,10.72 v1(65.53,10.72) ; v1(44.42,57.19) 44.42,57.28 ; v1(5.08,47.93) 5.95,47.93 v1(8.93,50.91) 8.93,52.81 9.56,53.45 9.56,56.75 10,57.19 R111.1 9.84,58.15 v1(8.13,59.87) ; v1(72.64,72.69) 74.6,74.65 v1(74.6,75.79) ; v1(7.37,66.34) U12#2.4 ; v1(8.25,87.94) U25.4
GND: length 322.5
  Top Layer w0.254: 70.88,91.37 70.49,90.98 70.49,86.51 R123.2 R124.2 ; 70.88,91.37 71.63,92.13 88.9,92.13 91.57,89.46 91.57,86.69 89.88,85 ; 70.88,91.37 69.61,92.63 v1(48.64,92.63) ; R3.6 37.08,88.56 37.08,87.43 31.75,87.43 31.12,86.79 v1(31.12,83.62) ; R126.2 89.7,85 89.88,85 ; 89.88,85 H2.6 ; v1(28.45,36.5) v1(29.84,36.5) ; U11#2.1 17.5,39.52 v1(19.18,41.2) v1(23.24,41.2) ; v1(22.73,8.05) 22.73,9.58 22.86,9.7 v1(26.29,9.7) ; LED16.2 87,82.73 R125.2 89.26,85.04 89.79,84.51 89.79,84.91 90.93,83.77 90.93,79.73 R226.1 ; v1(29.97,66.98) 29.97,66.34 38.61,57.71 38.61,57.58 39.75,56.44 v1(39.75,55.04) ; v1(24,15.16) 24,16.56 v1(24.51,17.07) ; v1(80.77,4.88) v1(80.77,2.34) ; v1(38.61,92.63) 42.29,92.63 v1(42.29,89.71)
  Bottom Layer w0.254: v1(19.18,41.2) 23.88,36.5 v1(28.45,36.5) 28.45,34.85 23.5,29.9 23.5,18.09 v1(24.51,17.07) ; v1(42.29,89.71) 43.56,89.71 46.23,92.38 48.1,92.38 48.36,92.63 v1(48.64,92.63) ; R3.6 37.15,88.8 R78.1 37.77,91.79 v1(38.61,92.63) ; v1(39.75,55.04) 39.73,55.04 33.63,48.95 33.63,41.69 29.84,37.9 v1(29.84,36.5) ; v1(29.97,66.98) 29.21,67.74 29.21,81.84 30.99,83.62 v1(31.12,83.62) ; v1(80.77,2.34) 78.36,4.75 26.03,4.75 v1(22.73,8.05) 24,9.32 v1(24,15.16) ; R4.6 76.93,6.53 R107.1 80.77,5.68 v1(80.77,4.88) ; v1(23.24,41.2) 23.75,41.2 23.88,41.33 24.77,40.44 24.77,39.93 25.15,39.55 25.15,38.79 25.55,38.79 v1(26.81,40.05) ; v1(26.29,9.7) 27.43,9.7 27.56,9.83 28.19,9.19 28.19,7.16 28.32,7.04 28.59,7.04 v1(30.11,8.56)
1_FAN_XIANG_BI_LI_QI_IN: length 62.1
  Bottom Layer w0.254: SW28.1 46.16,87.05 31.24,87.05 27.56,83.36 2.79,83.36 2.79,83.11 1.27,81.58 U11#2.13
1_FAN_XIANG_BI_LI_QI_OUT: length 71.6
  Bottom Layer w0.254: SW30.1 45.21,77.83 45.21,84.25 42.99,86.48 31.18,86.48 27.71,83.01 3.45,83.01 2.35,81.9 2.35,68.54 U11#2.12
2_TONG_XIANG_BI_LI_QI_IN: length 69.5
  Top Layer w0.254: SW28.2 50.99,89.01 49.66,87.68 46.1,87.68 v1(43.31,84.89)
  Bottom Layer w0.254: v1(43.31,84.89) 42.84,85.35 42.84,86.12 31.32,86.12 27.85,82.65 5.38,82.65 2.71,79.97 2.71,68.39 2.67,68.38 2.67,66.32 U11#2.11
2_TONG_XIANG_BI_LI_QI_OUT: length 54.8
  Bottom Layer w0.254: U11#2.10 15.59,62.38 17.53,64.31 38.74,64.31 47.12,72.69 48.77,72.69 50.67,74.6 SW30.2
3_TONG_XIANG_JIA_FA_QI_IN1: length 80.2
  Bottom Layer w0.254: SW28.3 53.53,89.01 51.94,87.43 48.77,87.43 45.57,84.23 45.57,81.86 52.2,75.23 52.2,73.71 50.82,72.34 47.26,72.34 38.88,63.96 17.67,63.96 15.74,62.02 3.45,62.02 U11#2.9
3_TONG_XIANG_JIA_FA_QI_IN2: length 109.8
  Bottom Layer w0.254: U11#2.8 5.33,61.36 5.33,61.67 15.89,61.67 17.82,63.6 39.03,63.6 47.41,71.98 50.97,71.98 51.94,72.95 54.23,72.95 54.74,73.46 54.74,75.49 52.07,78.16 49.78,78.16 45.92,82.01 45.92,84.08 48.92,87.07 75.84,87.07 76.84,88.06 SW29.3
3_TONG_XIANG_JIA_FA_QI_OUT: length 65.3
  Top Layer w0.254: SW30.3 55.25,72.88 v1(55.25,72.57)
  Bottom Layer w0.254: v1(55.25,72.57) 55.24,72.57 52.07,72.57 51.12,71.63 47.56,71.63 39.18,63.25 17.97,63.25 16.04,61.31 5.79,61.31 3.81,59.34 3.81,57.3 U11#2.7
4_FAN_XIANG_JIA_FA_QI_IN1: length 99.8
  Top Layer w0.254: v1(54.86,85.9) 56.07,87.11 SW28.4
  Bottom Layer w0.254: U11#2.6 3.17,54.12 3.17,56.16 4.17,57.15 4.17,59.19 5.93,60.96 16.18,60.96 18.12,62.89 39.32,62.89 47.71,71.27 51.27,71.27 52.21,72.22 52.5,71.93 56.64,71.93 57.4,72.69 57.4,75.74 53.85,79.3 49.14,79.3 46.28,82.16 46.28,83.93 49.06,86.72 54.05,86.72 v1(54.86,85.9)
4_FAN_XIANG_JIA_FA_QI_IN2: length 123
  Bottom Layer w0.254: SW29.4 78.25,88.21 77.19,88.21 77.19,87.91 75.99,86.72 72.31,86.72 69.34,83.74 69.34,74.09 67.38,72.13 57.34,72.13 56.79,71.58 55.91,71.58 53.47,69.14 53.47,55.3 50.93,52.76 42.29,52.76 42.29,57.71 37.47,62.53 18.26,62.53 16.33,60.6 6.08,60.6 4.52,59.04 4.52,57 3.53,56.01 3.53,53.98 2.79,53.24 2.79,51.2 U11#2.5
4_FAN_XIANG_JIA_FA_QI_OUT: length 95.4
  Top Layer w0.254: SW30.4 56.39,74.28 v1(56.39,70.79)
  Bottom Layer w0.254: U11#2.4 8.92,47.14 9.27,46.79 16.26,46.79 19.43,49.96 19.43,62.15 19.45,62.18 37.32,62.18 41.94,57.56 41.94,52.4 51.07,52.4 53.82,55.15 53.82,68.76 55.85,70.79 v1(56.39,70.79)
5_JIAN_FA_QI_IN1: length 57.9
  Top Layer w0.254: v1(12.06,88.06) 14.35,88.06 18.16,91.87 v1(18.16,92.13)
  Bottom Layer w0.254: SW28.5 57.21,90.73 51.56,90.73 43.81,98.48 21.84,98.48 R2#3.1 19.56,93.19 R73.2 18.49,92.13 v1(18.16,92.13) ; v1(12.06,88.06) U25.1 U25.2
5_JIAN_FA_QI_IN2: length 106.5
  Top Layer w0.254: R1#2.1 19.81,74.04 19.81,76.89 22.86,79.93 v1(30.1,79.93) ; v1(11.18,66.47) 12.57,66.47 16.51,70.41 v1(18.29,70.41) ; v1(30.1,74.22) 30.23,74.22 30.99,74.98 38.78,74.98 38.78,84.29 46.06,91.57 59.77,91.57 60.05,91.85 64.21,91.85 65.31,90.76 65.91,91.36 68.2,89.08 68.2,87.3 71.5,84 76.58,84 SW29.5
  Bottom Layer w0.254: U12#2.2 U12#2.1 v1(11.18,66.47) ; v1(30.1,74.22) v1(30.1,79.93) ; R1#2.1 19.65,70.88 R70.2 18.63,70.75 v1(18.29,70.41)
5_JIAN_FA_QI_OUT: length 50.4
  Top Layer w0.254: v1(42.16,81.08) 44.83,81.08 44.83,77.61 ; 44.83,77.61 44.87,77.65 55.56,77.65 SW30.5 ; 44.83,77.61 44.83,69.65 v1(39.12,69.65)
  Bottom Layer w0.254: v1(42.16,81.08) 38.1,77.01 34.93,77.01 33.91,78.03 v1(33.91,78.37) ; v1(39.12,69.65) 38.29,68.82 R81.1 37.72,65.83 R4#3.6
6_YI_YONG_FANG_DA_QI_IN1: length 52.7
  Top Layer w0.254: v1(66.42,59.11) U16.3 ; v1(48.23,57.28) 49.86,57.28 53.47,60.88 53.47,63.3 v1(62.48,63.3) 62.48,83.49 61.34,84.63 61.34,89.14 SW28.6
  Bottom Layer w0.254: 46.96,57.28 v1(48.23,57.28) ; v1(66.42,59.11) 66.42,60.76 66.29,60.88 64.9,60.88 v1(62.48,63.3)
6_YI_YONG_FANG_DA_QI_IN2: length 114.4
  Top Layer w0.254: v1(66.04,13) U17.3 ; v1(70.87,50.22) 69.22,51.87 69.22,81.08 71.75,83.62 76.7,83.62 79.88,86.79 81.91,86.79 SW29.6 ; v1(73.41,43.61) 73.41,34.47 65.91,26.97 65.91,20.24 65.41,19.74 65.41,15.93 64.52,15.04 62.61,15.04 v1(62.1,14.53) 51.05,14.53 49.75,13.22 v1(48.01,13.22)
  Bottom Layer w0.254: v1(62.1,14.53) 62.99,14.53 64.13,13.39 64.13,12.75 64.77,12.12 65.02,12.12 65.91,13 v1(66.04,13) ; v1(73.41,43.61) 70.87,46.15 v1(70.87,50.22) ; U14.2 v1(48.01,13.22)
6_YI_YONG_FANG_DA_QI_OUT: length 91.2
  Top Layer w0.254: v1(94.87,39.42) 98.81,39.42 98.81,61.47 v1(92.29,61.47) ; v1(61.59,70.54) 61.59,74.15 SW30.6 ; v1(87.5,36.75) U18.1
  Bottom Layer w0.254: v1(87.5,36.75) 88.14,36.12 88.14,34.47 89.92,34.47 v1(94.87,39.42) ; v1(61.59,70.54) 88.77,70.54 92.96,66.34 92.96,62.15 v1(92.29,61.47) 91.98,61.17 R104.1 90.72,58.18 R4#2.6
7_JI_FEN_IN: length 102.6
  Top Layer w0.254: v1(8.51,41.71) 8.25,41.45 6.35,41.45 6.35,49.45 12.95,49.45 v1(14.22,50.72) 14.86,51.36 14.86,55.42 16.89,57.45 21.34,57.45 21.34,60.38 29.21,68.25 35.94,68.25 39.5,71.81 39.5,84 46.35,90.86 61.47,90.86 62.99,89.33 SW28.7
  Bottom Layer w0.254: v1(14.22,50.72) 14.24,50.74 ; 14.24,50.74 U19.2 ; 14.24,50.74 U19.1 ; v1(8.51,41.71) 9.15,41.71 R112.2 9.91,42.46 R.1
7_JI_FEN_OUT: length 86.3
  Top Layer w0.254: 34.67,51.37 34.68,51.36 48.03,51.36 53.75,57.07 53.75,59.97 55.47,59.97 57.28,61.77 62.74,61.77 63.12,62.15 63.12,65.84 63.69,66.4 SW30.7 ; 34.67,51.37 34.67,42.72 v1(32,42.72) ; 34.67,51.37 34.67,54.53 34.64,54.5 v1(29.59,54.5) ; v1(24.13,40.06) 24.27,40.06 U20.1
  Bottom Layer w0.254: C1.2 23.06,54.49 C2.2 25.57,54.5 R115.1 v1(29.59,54.5) ; v1(32,42.72) 31.62,42.34 31.62,41.45 27.94,37.77 24.26,37.77 24.26,39.93 v1(24.13,40.06)
8_WEI_FEN_IN: length 143.1
  Top Layer w0.254: 9.4,12.62 9.4,14.02 ; 9.4,12.62 C.1 ; 9.4,12.62 9.27,12.5 6.48,12.5 6.48,19.86 v1(6.6,19.86) 12.14,19.86 v1(13.24,20.97) ; v1(4.57,40.56) 4.6,40.56 5.99,41.96 5.99,49.81 11.79,49.81 13.72,51.74 14.5,51.74 14.5,55.57 16.74,57.81 20.93,57.81 20.95,57.84 20.95,60.5 29.06,68.61 35.79,68.61 39.14,71.95 39.14,84.15 46.21,91.21 59.92,91.21 60.2,91.49 64.07,91.49 SW28.8
  Bottom Layer w0.254: v1(6.6,19.86) 5.46,21.01 5.46,29.64 6.65,30.84 6.65,38.36 4.57,40.44 v1(4.57,40.56) ; v1(13.24,20.97) 14.51,20.97
8_WEI_FEN_OUT: length 121.4
  Top Layer w0.254: v1(27.56,8.43) 27.57,8.44 U22.1 ; C5.2 37.72,18.47 ; 37.72,18.47 37.72,25.32 v1(32.51,25.32) 33.66,26.47 v1(33.66,32.44) ; 37.72,18.47 37.72,11.23 v1(35.56,11.23) ; v1(54.86,53.01) 59.69,53.01 64.52,57.84 64.52,72.89 SW30.8
  Bottom Layer w0.254: v1(35.56,11.23) 30.61,6.27 27.43,6.27 27.43,8.31 v1(27.56,8.43) ; v1(32.51,25.32) 31.85,24.66 R122.1 31.03,21.67 31.12,21.59 ; v1(33.66,32.44) 33.53,32.56 33.53,37.9 39.37,43.74 39.37,50.98 52.83,50.98 v1(54.86,53.01)
A0: length 31.1
  Top Layer w0.254: H2.1 96.25,74.73 74.42,74.73 73.66,75.49 73.66,76.36 R128.2 R127.1
A1: length 24.6
  Top Layer w0.254: R129.1 R130.2 78.37,77.39 79.12,76.63 83.06,76.63 84.58,75.11 98.41,75.11 H2.2
A2: length 22.4
  Top Layer w0.254: R131.1 R132.2 84.46,77.39 86.38,75.46 96.76,75.46 H2.3
$1N40974: length 15
  Bottom Layer w0.254: U12.3 13.33,85.91 13.33,93.78 14.1,94.54 14.1,95.8 R63.1 R64.2
$1N40975: length 14.8
  Bottom Layer w0.254: U12.1 7.49,85.63 7.49,89.84 10.16,92.51 10.16,95.06 R64.1 9.03,96.94 R65.2
$1N40980: length 3
  Bottom Layer w0.254: U12.2 10.27,86.17 9.53,86.92 U25.3
$1N40985: length 15
  Bottom Layer w0.254: R68.2 R67.1 13.21,74.21 13.21,72.95 12.45,72.19 12.45,64.32 U11.3
$1N40986: length 14.8
  Bottom Layer w0.254: U11.1 6.6,64.04 6.6,68.25 9.27,70.92 9.27,73.47 R68.1 8.88,73.85 7.37,75.35 R69.2
$1N40991: length 3
  Bottom Layer w0.254: U12#2.3 8.64,65.33 9.39,64.58 U11.2
$1N40994: length 9.4
  Bottom Layer w0.254: R1#2.2 22.19,70.88 R71.2 21.39,70.79 19.84,69.24 R70.1 19.65,69.12 R1#2.4
$1N40995: length 9.3
  Bottom Layer w0.254: R1#2.3 24.73,70.93 R72.2 23.61,69.81 22.95,69.81 22.42,69.28 R71.1 22.19,69.2 R1#2.5
$1N40996: length 9.4
  Bottom Layer w0.254: R2#3.2 22.1,93.19 R74.2 21.3,93.11 19.75,91.56 R73.1 19.56,91.43 R2#3.4
$1N40997: length 9.3
  Bottom Layer w0.254: R2#3.5 22.1,91.51 R74.1 22.33,91.6 22.86,92.13 23.52,92.13 R75.2 24.64,93.24 R2#3.3
$1N41006: length 9.4
  Bottom Layer w0.254: R3.2 34.69,93.34 34.61,93.25 33.9,93.25 32.35,91.7 R76.1 32.15,91.58 R3.4
$1N41007: length 9.3
  Bottom Layer w0.254: R3.3 37.23,93.39 37.15,93.3 36.12,92.27 35.46,92.27 34.93,91.74 R77.1 34.69,91.66 R3.5
$1N41009: length 33.5
  Top Layer w0.254: 29.21,92.38 29.21,82.74 29.22,82.73 v1(32.77,82.73) ; 29.21,92.38 v1(30.73,92.38) ; 29.21,92.38 v1(25.91,92.38)
  Bottom Layer w0.254: v1(36.45,78.37) 32.77,82.06 v1(32.77,82.73) ; v1(25.91,92.38) 25.28,92.38 R75.1 24.55,88.66 R2#3.6 ; v1(30.73,92.38) 31.2,92.38 R76.2 32.15,93.34 R3.1
$1N41010: length 9.4
  Bottom Layer w0.254: R4#3.4 32.73,68.61 R79.1 32.93,68.74 34.47,70.28 R80.2 35.27,70.37 R4#3.2
$1N41011: length 9.3
  Bottom Layer w0.254: R4#3.3 37.81,70.42 R81.2 36.7,69.3 36.03,69.3 35.5,68.78 R80.1 35.27,68.69 R4#3.5
$1N41012: length 31.4
  Top Layer w0.254: 29.21,69.27 29.21,78.79 32.13,78.79 v1(32.51,79.17) ; 29.21,69.27 31.24,69.27 v1(31.37,69.39) ; 29.21,69.27 26.03,69.27 v1(25.91,69.39)
  Bottom Layer w0.254: v1(31.37,69.39) 31.75,69.39 R79.2 32.73,70.37 R4#3.1 ; v1(25.91,69.39) 24.7,69.39 R72.1 24.64,66.34 R1#2.6 ; v1(32.51,79.17) 33.15,79.81 34.04,79.81 35.18,78.66 v1(35.18,78.37)
$1N41017: length 15
  Bottom Layer w0.254: R85.2 R84.1 50.04,21 50.04,19.74 49.28,18.97 49.28,11.11 U2.3
$1N41018: length 14.8
  Bottom Layer w0.254: U2.1 43.43,10.83 43.43,15.04 46.1,17.7 46.1,20.25 R85.1 44.98,22.14 R86.2
$1N41023: length 3
  Bottom Layer w0.254: U2.2 46.22,11.37 45.47,12.12 U14.3
$1N41028: length 15
  Bottom Layer w0.254: R89.2 R88.1 50.27,65.05 50.27,63.79 49.5,63.03 49.5,55.17 U1#2.3
$1N41029: length 14.8
  Bottom Layer w0.254: U1#2.1 43.66,54.89 43.66,59.09 46.33,61.76 46.33,64.31 R89.1 45.2,66.2 R90.2
$1N41034: length 3
  Bottom Layer w0.254: U1#2.2 46.44,55.43 45.69,56.17 45.69,57.28
$1N41045: length 9.4
  Bottom Layer w0.254: R2#2.4 62.14,48.81 R91.1 62.34,48.93 63.88,50.48 R92.2 64.68,50.57 R2#2.2
$1N41046: length 9.3
  Bottom Layer w0.254: R2#2.5 64.68,48.88 R92.1 64.92,48.97 65.44,49.5 66.11,49.5 R93.2 67.22,50.61 R2#2.3
$1N41047: length 9.4
  Bottom Layer w0.254: R1.2 55.04,38.83 R95.2 54.96,39.63 53.41,41.18 R94.1 53.28,41.37 R1.4
$1N41048: length 9.3
  Bottom Layer w0.254: R1.3 55.09,36.29 R96.2 53.98,37.41 53.98,38.07 53.45,38.6 R95.1 53.36,38.83 R1.5
$1N41049: length 9.4
  Bottom Layer w0.254: R2.4 67.19,29.28 R97.1 66.99,29.15 65.44,27.6 R98.2 64.65,27.51 R2.2
$1N41050: length 9.3
  Bottom Layer w0.254: R2.5 64.65,29.2 R98.1 64.41,29.11 63.88,28.58 63.22,28.58 R99.2 62.11,27.47 R2.3
$1N41051: length 45.5
  Top Layer w0.254: v1(60.71,49.45) 54.1,49.45 ; 54.1,49.45 54.1,59.61 v1(62.36,59.61) ; 54.1,49.45 v1(54.1,42.98) ; v1(65.15,59.11) U16.2
  Bottom Layer w0.254: v1(60.71,49.45) 61.03,49.45 R91.2 62.14,50.57 R2#2.1 ; v1(62.36,59.61) 63.37,60.63 64.01,60.63 65.15,59.49 v1(65.15,59.11) ; v1(54.1,42.98) 54.92,42.16 R94.2 55.04,41.37 R1.1
$1N41052: length 39.2
  Top Layer w0.254: R3#3.2 76.96,61.77 74.04,61.77 ; 74.04,61.77 v1(71.5,61.77) ; 74.04,61.77 74.04,49.58 73.79,49.33 v1(68.71,49.33)
  Bottom Layer w0.254: R2#2.6 67.14,46.03 R93.1 68.4,49.02 v1(68.71,49.33) ; v1(63.88,59.07) 63.88,57.84 64.39,57.33 67.69,57.33 71.5,61.14 v1(71.5,61.77)
$1N41053: length 46.9
  Top Layer w0.254: v1(54.23,34.85) 54.23,28.25 ; 54.23,28.25 v1(60.71,28.25) ; 54.23,28.25 54.23,18.09 54.48,17.83 v1(62.1,17.83)
  Bottom Layer w0.254: R1.6 50.51,36.38 R96.1 53.5,35.58 v1(54.23,34.85) ; v1(64.77,13.09) 64.77,13.39 62.1,16.05 v1(62.1,17.83) ; R2.6 62.19,32.05 R99.1 61.52,29.06 v1(60.71,28.25)
$1N41058: length 39
  Top Layer w0.254: 74.17,16.18 74.17,28.37 v1(68.71,28.37) ; 74.17,16.18 R3#2.2 ; 74.17,16.18 v1(71.88,16.18)
  Bottom Layer w0.254: v1(71.88,16.18) 71.88,16.05 67.31,11.48 64.52,11.48 63.5,12.5 v1(63.5,13.09) ; v1(68.71,28.37) 67.98,27.64 R97.2 67.19,27.51 R2.1
$1N41063: length 9.4
  Bottom Layer w0.254: R4#2.4 85.72,60.95 R102.1 85.92,61.08 87.47,62.62 R103.2 88.26,62.71 R4#2.2
$1N41064: length 9.3
  Bottom Layer w0.254: R4#2.3 90.81,62.76 R104.2 89.69,61.65 89.03,61.65 88.5,61.12 R103.1 88.26,61.03 R4#2.5
$1N41065: length 9.4
  Bottom Layer w0.254: R4.4 79.7,11.53 R105.1 79.83,11.33 81.37,9.78 R106.2 81.46,8.99 R4.2
$1N41066: length 9.3
  Bottom Layer w0.254: R4.5 79.78,8.99 R106.1 79.87,8.75 80.39,8.22 80.39,7.56 R107.2 81.51,6.45 R4.3
$1N41068: length 41.6
  Top Layer w0.254: 80.9,16.18 80.9,37.77 v1(86.49,37.77) ; 80.9,16.18 v1(80.9,13.13) ; 80.9,16.18 R3#2.1 ; v1(90.04,36.88) 90.04,36.72
  Bottom Layer w0.254: v1(80.9,13.13) 81.33,12.7 R105.2 81.46,11.53 R4.1 ; v1(90.04,36.88) 89.15,37.77 v1(86.49,37.77)
$1N41069: length 48.6
  Top Layer w0.254: v1(86.11,41.2) 80.9,41.2 80.9,61.76 ; 80.9,61.76 R3#3.1 ; 80.9,61.76 84.13,61.76 v1(84.29,61.6) ; v1(88.77,36.75) U18.2
  Bottom Layer w0.254: v1(84.29,61.6) 84.61,61.6 R102.2 85.72,62.71 R4#2.1 ; v1(86.11,41.2) 88.9,38.41 90.55,38.41 90.68,38.28 90.68,35.74 90.04,35.1 89.03,35.1 88.77,35.36 v1(88.77,36.75)
$1N41074: length 15
  Bottom Layer w0.254: U1.3 15.53,48.63 15.53,56.49 16.29,57.26 16.29,58.52 R109.1 R110.2
$1N41075: length 14.8
  Bottom Layer w0.254: U1.1 9.69,48.35 9.69,52.56 12.36,55.22 12.36,57.77 R110.1 11.23,59.66 R111.2
$1N41080: length 3
  Bottom Layer w0.254: U19.3 11.72,49.64 12.47,48.89 U1.2
$1N41087: length 9.4
  Bottom Layer w0.254: R.4 9.91,40.7 R112.1 10.1,40.83 11.65,42.38 R113.2 12.45,42.46 R.2
$1N41088: length 9.3
  Bottom Layer w0.254: R.5 12.45,40.78 R113.1 12.68,40.87 13.21,41.4 13.87,41.4 R114.2 14.99,42.51 R.3
$1N41092: length 3.1
  Bottom Layer w0.254: C1.1 23.02,50.12 C#2.4
$1N41093: length 3
  Bottom Layer w0.254: C#2.5 25.53,53.06 C2.1
$1N41094: length 41
  Top Layer w0.254: 25.54,40.05 25.53,40.05 v1(25.4,40.18) ; v1(23.11,44.25) 19.16,44.25 19.18,44.27 ; 19.18,44.27 16.36,44.27 16.26,44.37 v1(16.26,41.83) ; 19.18,44.27 19.18,53.39 19.3,53.52 v1(21.59,53.52)
  Bottom Layer w0.254: v1(16.26,41.83) 15.34,40.92 R114.1 14.9,37.93 R.6 ; v1(21.59,53.52) 21.59,56.31 C#2.1 C#2.2 C#2.3 ; v1(23.11,44.25) 23.11,43.87 25.4,41.58 v1(25.4,40.18)
$1N41095: length 2.9
  Bottom Layer w0.254: C#2.6 R115.2
$1N41100: length 15
  Bottom Layer w0.254: U1#3.3 15.78,18.86 15.78,26.72 16.54,27.48 16.54,28.75 15.4,29.89 12.99,29.89
$1N41101: length 14.8
  Bottom Layer w0.254: 10.25,29.89 11.48,29.89 R118.1 12.61,28 12.61,25.45 9.94,22.79 9.94,18.58 U1#3.1
$1N41106: length 3
  Bottom Layer w0.254: U1#3.2 12.72,19.12 11.97,19.87 11.97,20.97
$1N41114: length 9.4
  Bottom Layer w0.254: R1#3.2 28.57,26.21 R121.2 27.78,26.12 26.23,24.57 R120.1 26.03,24.45 26.03,21.59
$1N41115: length 9.3
  Bottom Layer w0.254: 31.12,29.21 31.12,26.26 R122.2 30,25.14 29.34,25.14 28.81,24.61 R121.1 28.57,24.53 R1#3.5
$1N41116: length 3
  Top Layer w0.254: C3.1 19.69,11.48 C.3
$1N41117: length 2.9
  Top Layer w0.254: 17.02,14.02 C4.1
$1N41120: length 37
  Top Layer w0.254: C5.1 22.99,18.47 ; 22.99,18.47 22.99,12.91 22.95,12.87 ; 22.99,18.47 22.99,25.58 v1(24.64,25.58) ; C4.2 21.34,12.87 ; 21.34,12.87 22.95,12.87 ; 21.34,12.87 C3.2 ; v1(28.83,8.56) 28.83,8.56 U22.2 ; v1(26.03,12.88) 26.02,12.87 22.95,12.87
  Bottom Layer w0.254: v1(24.64,25.58) 25.14,26.08 R120.2 26.03,26.21 26.03,29.21 ; v1(26.03,12.88) 28.7,10.21 28.83,10.21 v1(28.83,8.56)
$1N41163: length 2.6
  Top Layer w0.254: SW29.1 71.75,86.75
$1N41164: length 2.6
  Top Layer w0.254: SW29.2 74.29,86.88 74.17,86.75
$1N41165: length 2.8
  Top Layer w0.254: SW29.7 R125.1
$1N41166: length 2.8
  Top Layer w0.254: SW29.8 89.53,86.67 R126.1
$1N41258: length 38.7
  Top Layer w0.254: v1(74.42,81.33) 74.44,81.32 R127.2 ; v1(70.61,83.74) 70.61,84.25 v1(67.18,87.68)
  Bottom Layer w0.254: v1(67.18,87.68) 68.33,88.82 68.33,94.85 SW28.16 SW28.15 SW28.14 SW28.13 SW28.12 SW28.11 SW28.10 SW28.9 ; v1(74.42,81.33) 72.01,83.74 v1(70.61,83.74)
$1N41259: length 47.5
  Bottom Layer w0.254: SW29.9 SW29.10 SW29.11 SW29.12 SW29.13 SW29.14 SW29.15 SW29.16 92.33,94.16 92.33,84.63 91.19,83.49 79.38,83.49 77.6,81.71 v1(77.6,81.37)
$1N41260: length 34.9
  Top Layer w0.254: SW30.16 66.99,82.98 v1(69.98,82.98)
  Bottom Layer w0.254: SW30.9 SW30.10 SW30.11 SW30.12 SW30.13 SW30.14 SW30.15 SW30.16 ; v1(69.98,82.98) 69.85,82.86 69.85,81.08 70.36,80.57 79.59,80.57 v1(80.39,81.37)
$1N44165: length 2.2
  Top Layer w0.254: LED16.1 89.97,81.26 R225.2
$1N44169: length 2.2
  Top Layer w0.254: R226.2 87.74,78.68 LED17.1

## Copper pours and planes (outline as drawn; the poured copper is in the pictures)
GND on Top Layer: 4.83,99.62 95.12,99.62 95.12,0.69 4.83,0.69
GND on Bottom Layer: 4.83,99.62 95.12,99.62 95.12,0.69 4.83,0.69

## Text on the board
Top Silkscreen Layer: +5V | G | -5V | A0 | A2 | A1 | 微分电路 | 积分电路 | 减法器 | out5 | Vo | 仪用放大电路 | out8 | out6 | out7 | + | -
